# Altium schematic sheet [03] - BLOCK DIAGRAM.SchDoc: Test title
size A4; PageSetup: Record=PageOptions|CenterHorizontal=True|CenterVertical=True|PrintScale=0.52|XCorrection=1.00|YCorrection=1.00|PrintKind=1|BorderSize=5000000|LeftOffset=0|BottomOffset=0|Orientation=2|PaperLength=1000|PaperWidth=1000|Scale=100|PaperSource=4|PrintQuality=600|MediaType=1|DitherType=10|PrintScaleMode=1|PaperKind=A4|PaperIndex=9; Projectnumber: OWN-000; Project name:: Test name; Client: DSG; Date: YYYY-MM-DD; Engineer: X; SheetNumber: 3; Size: A4
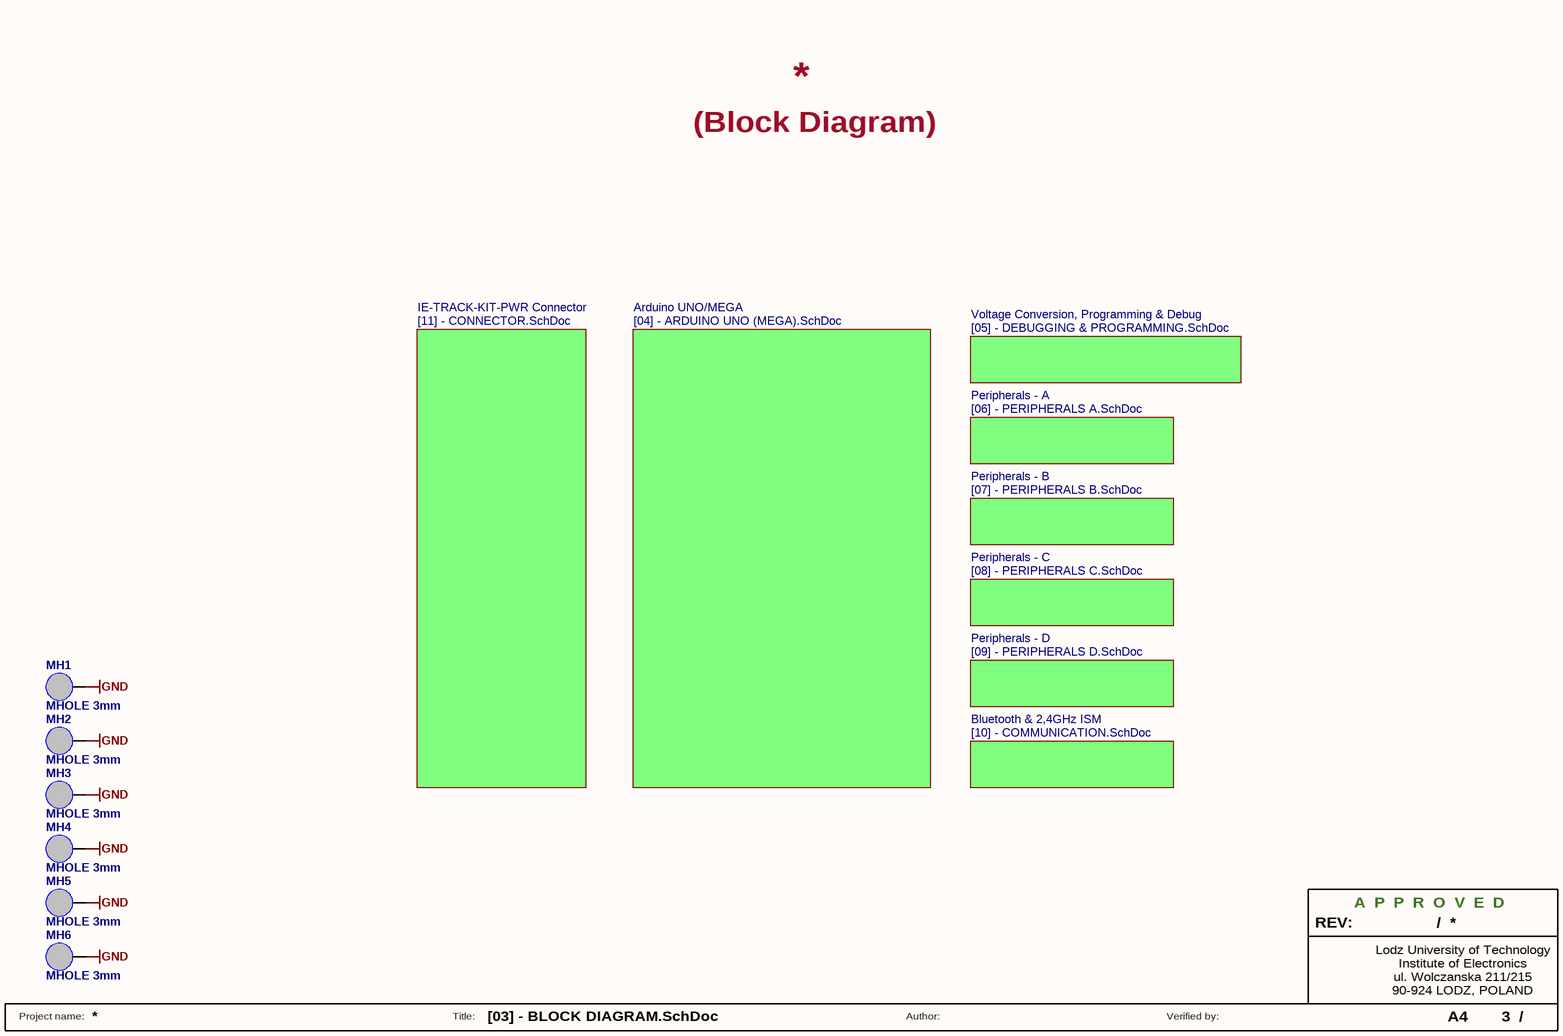
[diagram p0: [03] - BLOCK DIAGRAM.SchDoc]

## Parts
MH1  MHOLE 3mm  [3mm screw drill I]  (no BOM)
MH2  MHOLE 3mm  [3mm screw drill I]  (no BOM)
MH3  MHOLE 3mm  [3mm screw drill I]  (no BOM)
MH4  MHOLE 3mm  [3mm screw drill I]  (no BOM)
MH5  MHOLE 3mm  [3mm screw drill I]  (no BOM)
MH6  MHOLE 3mm  [3mm screw drill I]  (no BOM)

## Sub-sheets
Arduino UNO/MEGA = [04] - ARDUINO UNO (MEGA).SchDoc: no entries
Bluetooth & 2,4GHz ISM = [10] - COMMUNICATION.SchDoc: no entries
IE-TRACK-KIT-PWR Connector = [11] - CONNECTOR.SchDoc: no entries
Peripherals - A = [06] - PERIPHERALS A.SchDoc: no entries
Peripherals - B = [07] - PERIPHERALS B.SchDoc: no entries
Peripherals - C = [08] - PERIPHERALS C.SchDoc: no entries
Peripherals - D = [09] - PERIPHERALS D.SchDoc: no entries
Voltage Conversion, Programming & Debug = [05] - DEBUGGING & PROGRAMMING.SchDoc: no entries

## Nets
GND: MH1.1(GND) MH2.1(GND) MH3.1(GND) MH4.1(GND) MH5.1(GND) MH6.1(GND)

## Notes on the sheet
- (Block Diagram)
- REV:
- A  P  P  R  O  V  E  D
- /
- Lodz University of Technology
- ul. Wolczanska 211/215
- 90-924 LODZ, POLAND
- Institute of Electronics
- Project name:
- Title:
- Author:
- Verified by:

## Library data of the parts
MH1-MH6 = MHOLE_3MM: 3mm Mounting Hole